# Altium schematic sheet Switch.SchDoc
size A; DocumentNumber: 2; SheetNumber: 2; SheetTotal: 6; SPICEModelCacheIVTIOJWM: <root> / <DocumentId>IVTIOJWM</DocumentId> / </root>
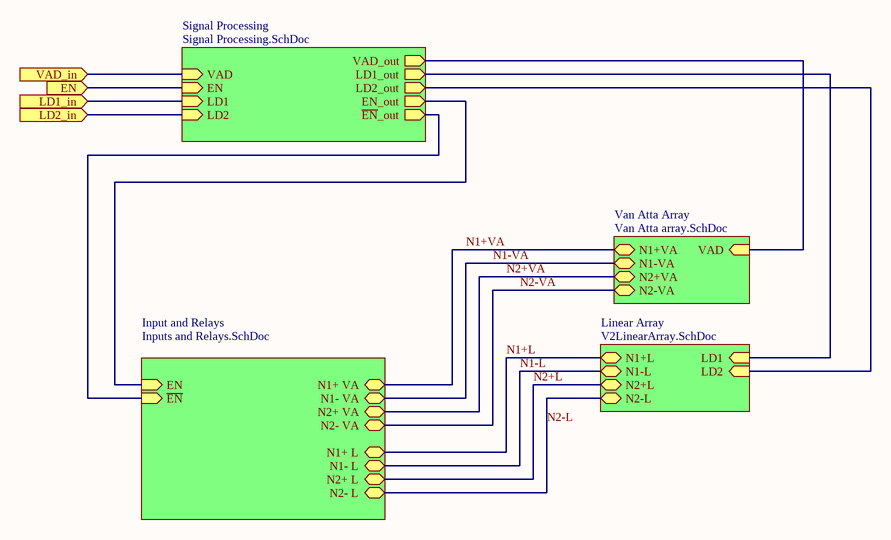
[diagram p0: Switch.SchDoc]

## Sub-sheets
Input and Relays = Inputs and Relays.SchDoc: N1- L (bidir), N2+ L (bidir), N1+ L (bidir), N2- VA (bidir), EN (in), ~{EN} (in), N1- VA (bidir), N1+ VA (bidir), N2- L (bidir), N2+ VA (bidir)
Linear Array = V2LinearArray.SchDoc: N1-L (bidir), N1+L (bidir), N2+L (bidir), N2-L (bidir), LD2 (in), LD1 (in)
Signal Processing = Signal Processing.SchDoc: EN (in), EN_out (out), ~{EN}_out (out), LD1 (in), LD1_out (out), LD2 (in), VAD (in), LD2_out (out), VAD_out (out)
Van Atta Array = Van Atta array.SchDoc: N2-VA (bidir), N1-VA (bidir), N1+VA (bidir), N2+VA (bidir), VAD (in)

## Ports
EN (in), LD1_in (in), LD2_in (in), VAD_in (in)

## Nets
EN: port EN, sheet Signal Processing/EN
LD1_in: port LD1_in, sheet Signal Processing/LD1
LD2_in: port LD2_in, sheet Signal Processing/LD2
N1+L: sheet Input and Relays/N1+ L, sheet Linear Array/N1+L
N1+VA: sheet Van Atta Array/N1+VA, sheet Input and Relays/N1+ VA
N1-L: sheet Input and Relays/N1- L, sheet Linear Array/N1-L
N1-VA: sheet Van Atta Array/N1-VA, sheet Input and Relays/N1- VA
N2+L: sheet Input and Relays/N2+ L, sheet Linear Array/N2+L
N2+VA: sheet Van Atta Array/N2+VA, sheet Input and Relays/N2+ VA
N2-L: sheet Input and Relays/N2- L, sheet Linear Array/N2-L
N2-VA: sheet Van Atta Array/N2-VA, sheet Input and Relays/N2- VA
VAD_in: port VAD_in, sheet Signal Processing/VAD
(unnamed): sheet Van Atta Array/VAD, sheet Signal Processing/VAD_out
(unnamed): sheet Signal Processing/EN_out, sheet Input and Relays/EN
(unnamed): sheet Signal Processing/~{EN}_out, sheet Input and Relays/~{EN}
(unnamed): sheet Signal Processing/LD1_out, sheet Linear Array/LD1
(unnamed): sheet Signal Processing/LD2_out, sheet Linear Array/LD2